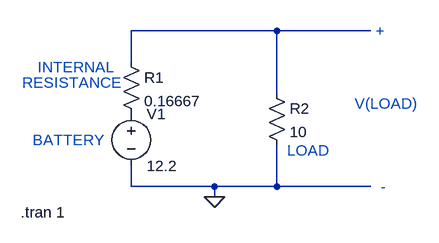
[diagram p0: schematic Draft5.asc]
Draft5.asc, the LTspice schematic file:
Version 4
SHEET 1 880 680
WIRE 304 -16 80 -16
WIRE 448 -16 304 -16
WIRE 80 32 80 -16
WIRE 304 80 304 -16
WIRE 80 224 80 192
WIRE 208 224 80 224
WIRE 304 224 304 160
WIRE 304 224 208 224
WIRE 448 224 304 224
WIRE 208 240 208 224
FLAG 208 240 0
SYMBOL voltage 80 96 R0
WINDOW 123 0 0 Left 0
WINDOW 39 0 0 Left 0
SYMATTR InstName V1
SYMATTR Value 12.2
SYMBOL res 64 16 R0
SYMATTR InstName R1
SYMATTR Value 0.16667
SYMBOL res 288 64 R0
SYMATTR InstName R2
SYMATTR Value 10
TEXT 320 168 Left 2 ;LOAD
TEXT -64 40 Left 2 ;INTERNAL
TEXT -88 64 Left 2 ;RESISTANCE
TEXT -72 152 Left 2 ;BATTERY
TEXT 456 -16 Left 2 ;+
TEXT 464 224 Left 2 ;-
TEXT 424 96 Left 2 ;V(LOAD)
TEXT -90 264 Left 2 !.tran 1

The netlist it stands for:
* Draft5.asc
V1 P001 0 12.2
R1 N001 P001 0.16667
R2 N001 0 10
* LOAD
* INTERNAL
* RESISTANCE
* BATTERY
* +
* -
* V(LOAD)
.tran 1
.backanno
.end